# Altium schematic sheet Microcontroller.SchDoc
size A4; SheetNumber: 8; SheetTotal: 10
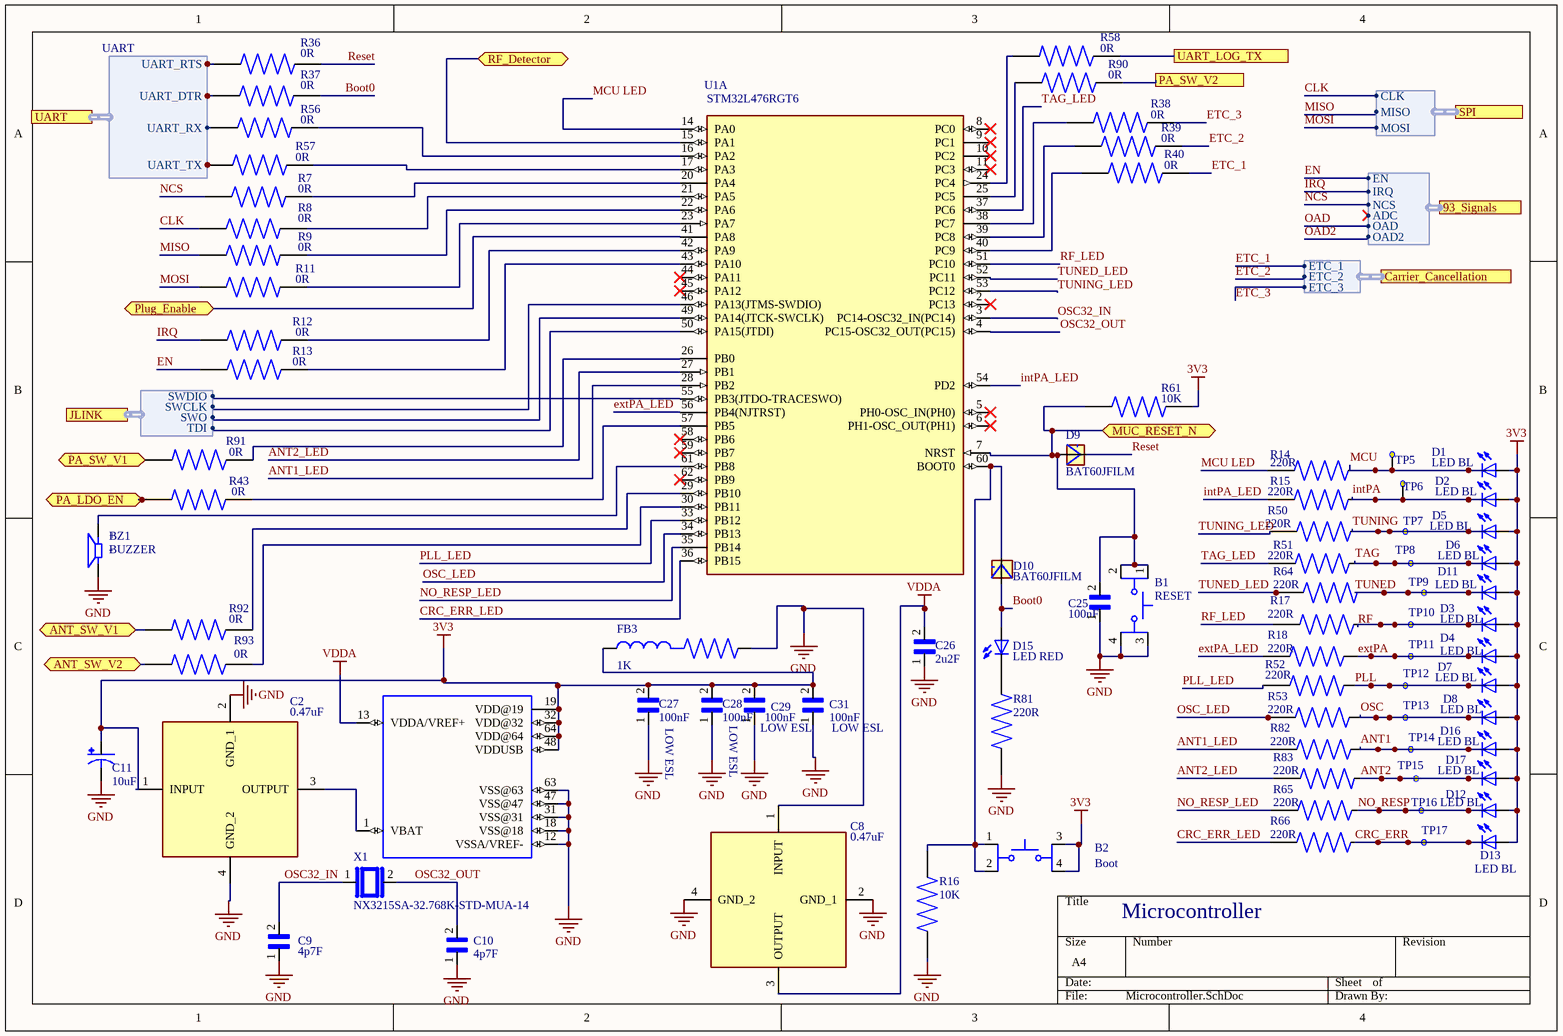
[diagram p0: Microcontroller.SchDoc]

## Parts
B1  RESET  [SW_TL3301AF160QG]
B2  Boot  [SW_TL3301AF160QG]
BZ1  BUZZER  [SPKR_PKMCS0909E4000-R1]
C2  0.47uF  [NFM18CC101R1C3D]
C8  0.47uF  [NFM18CC101R1C3D]
C9  4p7F  [CAPC1005X55N]
C10  4p7F  [CAPC1005X55N]
C11  10uF  [2917(POL)]
C25  100nF  [CAPC1005X55N]
C26  2u2F  [CAPC0603X35N]
C27  100nF  [CAPC0510X35N]
C28  100nF  [CAPC0510X35N]
C29  100nF  [CAPC0510X35N]
C31  100nF  [CAPC0510X35N]
D1  LED BL  [LED_0402]
D2  LED BL  [LED_0402]
D3  LED BL  [LED_0402]
D4  LED BL  [LED_0402]
D5  LED BL  [LED_0402]
D6  LED BL  [LED_0402]
D7  LED BL  [LED_0402]
D8  LED BL  [LED_0402]
D9  BAT60JFILM  [SOD323]
D10  BAT60JFILM  [SOD323]
D11  LED BL  [LED_0402]
D12  LED BL  [LED_0402]
D13  LED BL  [LED_0402]
D15  LED RED  [LED_0402]
D16  LED BL  [LED_0402]
D17  LED BL  [LED_0402]
FB3  1K  [BEADC1005X55N]
R7  0R  [RESC1005X37N]
R8  0R  [RESC1005X37N]
R9  0R  [RESC1005X37N]
R11  0R  [RESC1005X37N]
R12  0R  [RESC1005X37N]
R13  0R  [RESC1005X37N]
R14  220R  [RESC1005X40N]
R15  220R  [RESC1005X40N]
R16  10K  [RESC1005X40N]
R17  220R  [RESC1005X40N]
R18  220R  [RESC1005X40N]
R36  0R  [RESC1005X37N]
R37  0R  [RESC1005X37N]
R38  0R  [RESC1005X37N]
R39  0R  [RESC1005X37N]
R40  0R  [RESC1005X37N]
R43  0R  [RESC1005X37N]
R50  220R  [RESC1005X40N]
R51  220R  [RESC1005X40N]
R52  220R  [RESC1005X40N]
R53  220R  [RESC1005X40N]
R56  0R  [RESC1005X37N]
R57  0R  [RESC1005X37N]
R58  0R  [RESC1005X37N]
R61  10K  [RESC1005X40N]
R64  220R  [RESC1005X40N]
R65  220R  [RESC1005X40N]
R66  220R  [RESC1005X40N]
R81  220R  [RESC1005X40N]
R82  220R  [RESC1005X40N]
R83  220R  [RESC1005X40N]
R90  0R  [RESC1005X37N]
R91  0R  [RESC1005X37N]
R92  0R  [RESC1005X37N]
R93  0R  [RESC1005X37N]
TP5  Testpoint  [Testpoint_FP]  (value not drawn)
TP6  Testpoint  [Testpoint_FP]  (value not drawn)
TP7  Testpoint  [Testpoint_FP]  (value not drawn)
TP8  Testpoint  [Testpoint_FP]  (value not drawn)
TP9  Testpoint  [Testpoint_FP]  (value not drawn)
TP10  Testpoint  [Testpoint_FP]  (value not drawn)
TP11  Testpoint  [Testpoint_FP]  (value not drawn)
TP12  Testpoint  [Testpoint_FP]  (value not drawn)
TP13  Testpoint  [Testpoint_FP]  (value not drawn)
TP14  Testpoint  [Testpoint_FP]  (value not drawn)
TP15  Testpoint  [Testpoint_FP]  (value not drawn)
TP16  Testpoint  [Testpoint_FP]  (value not drawn)
TP17  Testpoint  [Testpoint_FP]  (value not drawn)
U1A  STM32L476RGT6  [LQFP-64(10X10)MM]
X1  NX3215SA-32.768K-STD-MUA-14  [XTAL_NX3215SA-32.768K-STD-MUA-14]

## Ports
93_Signals (harness 93_Signals, see System Overview[2B], External interfaces and connections[1B], UHF RFID READER IC[1A]), ANT_SW_V1 (bidir, see System Overview[2C], Antenna Switch[2B], External interfaces and connections[3D]), ANT_SW_V2 (bidir, see System Overview[2C], Antenna Switch[2B], External interfaces and connections[3D]), Carrier_Cancellation (harness Carrier Cancellation, see System Overview[2B], Carrier Cancellation Circuit[1A], External interfaces and connections[1A]), JLINK (harness JLINK, see System Overview[2C], External interfaces and connections[4A]), MUC_RESET_N (bidir, see System Overview[2C], External interfaces and connections[4B]), PA_LDO_EN (bidir, see System Overview[2C], External interfaces and connections[1D], Supply LDOs[2C]), PA_SW_V1 (bidir, see System Overview[2C], External interfaces and connections[3C], External Power Amplifier[4A]), PA_SW_V2 (see System Overview[2C], External interfaces and connections[3D], External Power Amplifier[4A]), Plug_Enable (bidir, see System Overview[2D], Supply LDOs[1B]), RF_Detector (bidir, see System Overview[2C], External interfaces and connections[4D], External Power Amplifier[3D]), SPI (harness SPI, see System Overview[2B], Carrier Cancellation Circuit[1A], External interfaces and connections[1A], UHF RFID READER IC[1A]), UART (harness UART, see System Overview[2C], External interfaces and connections[1C], USB suply_UART bridge[4D]), UART_LOG_TX (see System Overview[2C], External interfaces and connections[1D])

## Harnesses
UART: UART_RTS, UART_DTR, UART_RX, UART_TX
JLINK: SWDIO, SWCLK, SWO, TDI
SPI: CLK, MISO, MOSI
93_Signals: EN, IRQ, NCS, ADC, OAD, OAD2
Carrier Cancellation: ETC_1, ETC_2, ETC_3

## Nets
3V3: B2.3 B2.4 C2.1(INPUT) C11.1(POS) C27.2 C28.2 C29.2 C31.2 D1.A D2.A D3.A D4.A D5.A D6.A D7.A D8.A D11.A D12.A D13.A D16.A D17.A FB3.1 R61.2 U1A.19(VDD@19) U1A.32(VDD@32) U1A.48(VDDUSB) U1A.64(VDD@64)
GND: B1.3 B1.4 BZ1.2(N) C2.2(GND_1) C2.4(GND_2) C8.1(INPUT) C8.2(GND_1) C8.4(GND_2) C9.1 C10.1 C11.2(NEG) C25.1 C26.1 C27.1 C28.1 C29.1 C31.1 FB3.2 R16.1 R81.1 U1A.12(VSSA/VREF-) U1A.18(VSS@18) U1A.31(VSS@31) U1A.47(VSS@47) U1A.63(VSS@63)
VDDA: C8.3(OUTPUT) C26.2 U1A.13(VDDA/VREF+)
ANT1: D16.C R82.2 TP14.TP?(Testpoint)
ANT1_LED: R82.1 U1A.28(PB2)
ANT2: D17.C R83.2 TP15.TP?(Testpoint)
ANT2_LED: R83.1 U1A.27(PB1)
ANT_SW_V1: R92.1 ; port ANT_SW_V1
ANT_SW_V2: R93.1 ; port ANT_SW_V2
Boot0: D10.A D15.A R37.2
CLK: R8.1 ; port SPI.CLK
CRC_ERR: D13.C R66.2 TP17.TP?(Testpoint)
CRC_ERR_LED: R66.1 U1A.36(PB15)
EN: R13.1 ; port 93_Signals.EN
ETC_1: R40.2 ; port Carrier_Cancellation.ETC_1
ETC_2: R39.2 ; port Carrier_Cancellation.ETC_2
ETC_3: R38.2 ; port Carrier_Cancellation.ETC_3
extPA: D4.C R18.2 TP11.TP?(Testpoint)
extPA_LED: R18.1 U1A.56(PB4(NJTRST))
intPA: D2.C R15.2 TP6.TP?(Testpoint)
intPA_LED: R15.1 U1A.54(PD2)
IRQ: R12.1 ; port 93_Signals.IRQ
MCU: D1.C R14.2 TP5.TP?(Testpoint)
MCU LED: R14.1 U1A.14(PA0)
MISO: R9.1 ; port SPI.MISO
MOSI: R11.1 ; port SPI.MOSI
MUC_RESET_N: B1.1 B1.2 C25.2 D9.A R61.1 U1A.7(NRST) ; port MUC_RESET_N
NCS: R7.1 ; port 93_Signals.NCS
NO_RESP: D12.C R65.2 TP16.TP?(Testpoint)
NO_RESP_LED: R65.1 U1A.35(PB14)
OAD: port 93_Signals.OAD
OAD2: port 93_Signals.OAD2
OSC: D8.C R53.2 TP13.TP?(Testpoint)
OSC32_IN: C9.2 U1A.3(PC14-OSC32_IN(PC14)) X1.1
OSC32_OUT: C10.2 U1A.4(PC15-OSC32_OUT(PC15)) X1.2
OSC_LED: R53.1 U1A.34(PB13)
PA_LDO_EN: R43.1 ; port PA_LDO_EN
PA_SW_V1: R91.1 ; port PA_SW_V1
PA_SW_V2: R90.2 ; port PA_SW_V2
PLL: D7.C R52.2 TP12.TP?(Testpoint)
PLL_LED: R52.1 U1A.33(PB12)
Plug_Enable: U1A.41(PA8) ; port Plug_Enable
Reset: D9.C R36.2
RF: D3.C R17.2 TP10.TP?(Testpoint)
RF_Detector: U1A.15(PA1) ; port RF_Detector
RF_LED: R17.1 U1A.51(PC10)
TAG: D6.C R51.2 TP8.TP?(Testpoint)
TAG_LED: R51.1 U1A.37(PC6)
TUNED: D11.C R64.2 TP9.TP?(Testpoint)
TUNED_LED: R64.1 U1A.52(PC11)
TUNING: D5.C R50.2 TP7.TP?(Testpoint)
TUNING_LED: R50.1 U1A.53(PC12)
UART_LOG_TX: R58.2 ; port UART_LOG_TX
NetB2_1: B2.1 B2.2 D10.C R16.2 U1A.60(BOOT0)
NetBZ1_1: BZ1.1(P) U1A.61(PB8)
NetC2_3: C2.3(OUTPUT) U1A.1(VBAT)
NetD15_C: D15.C R81.2
NetR7_2: R7.2 U1A.20(PA4)
NetR8_2: R8.2 U1A.21(PA5)
NetR9_2: R9.2 U1A.22(PA6)
NetR11_2: R11.2 U1A.23(PA7)
NetR12_2: R12.2 U1A.42(PA9)
NetR13_2: R13.2 U1A.43(PA10)
NetR36_1: R36.1 ; port UART.UART_RTS
NetR37_1: R37.1 ; port UART.UART_DTR
NetR38_1: R38.1 U1A.38(PC7)
NetR39_1: R39.1 U1A.39(PC8)
NetR40_1: R40.1 U1A.40(PC9)
NetR43_2: R43.2 U1A.57(PB5)
NetR56_1: R56.1 ; port UART.UART_RX
NetR56_2: R56.2 U1A.16(PA2)
NetR57_1: R57.1 ; port UART.UART_TX
NetR57_2: R57.2 U1A.17(PA3)
NetR58_1: R58.1 U1A.24(PC4)
NetR90_1: R90.1 U1A.25(PC5)
NetR91_2: R91.2 U1A.26(PB0)
NetR92_2: R92.2 U1A.29(PB10)
NetR93_2: R93.2 U1A.30(PB11)
NetU1A_46: U1A.46(PA13(JTMS-SWDIO)) ; port JLINK.SWCLK
NetU1A_49: U1A.49(PA14(JTCK-SWCLK)) ; port JLINK.SWO
NetU1A_50: U1A.50(PA15(JTDI)) ; port JLINK.TDI
NetU1A_55: U1A.55(PB3(JTDO-TRACESWO)) ; port JLINK.SWDIO

Not connected (* = marked no-connect by the designer): U1A 2(PC13)* 5(PH0-OSC_IN(PH0))* 6(PH1-OSC_OUT(PH1))* 8(PC0)* 9(PC1)* 10(PC2)* 11(PC3)* 44(PA11)* 45(PA12)* 58(PB6)* 59(PB7)* 62(PB9)*

## Notes on the sheet
- (near U1A) LOW ESL
- Microcontroller
- (in symbol PKMCS0909E4000-R1) +; -

## Library data of the parts
B1 B2 = TL3301AF160QG: Tactile Switch SPST-NO Top Actuated Surface Mount; MF: E-Switch; SnapEDA_Link: https://www.snapeda.com/parts/TL3301AF160QG/E-Switch/view-part/?ref=snap; Package: None; MP: TL3301AF160QG; Check_prices: https://www.snapeda.com/parts/TL3301AF160QG/E-Switch/view-part/?ref=eda; Purchase-URL: https://pricing.snapeda.com/search/part/TL3301AF160QG/?ref=eda; Digi-Key_Part_Number: EG2526TR-ND; Value: *
BZ1 = PKMCS0909E4000-R1: Buzzers Transducer, Externally Driven Piezo 1.5V 4kHz 65dB @ 1.5V, 10cm Surface Mount Solder Pads; MF: Murata; SnapEDA_Link: https://www.snapeda.com/parts/PKMCS0909E4000-R1/Murata/view-part/4970136/?ref=snap; Arrow_Electronics-Purchase-URL: https://snapeda.com/shop?store=Arrow+Electronics&id=4970136; DigiKey-Purchase-URL: https://snapeda.com/shop?store=DigiKey&id=4970136; Digi-Key_Part_Number: 490-9647-1-ND; MP: PKMCS0909E4000-R1; Package: SMD-2 Murata; Mouser-Purchase-URL: https://snapeda.com/shop?store=Mouser&id=4970136; Value: *
C2 C8 = NFM18PS474R0J3D: Capacitor; Manufacturer_Name: Murata Electronics; Datasheet Link: https://psearch.en.murata.com/capacitor/product/NFM18PS474R0J3%23.html; Height: 0.7mm; Manufacturer_Part_Number: NFM18PS474R0J3D; Mouser Part Number: 81-NFM18PS474R0J3D; Mouser Price/Stock: https://www.mouser.co.uk/ProductDetail/Murata-Electronics/NFM18PS474R0J3D?qs=OWtbBJ4e7yHgIGJxSdBqtA%3D%3D; Arrow Part Number: NFM18PS474R0J3D; Arrow Price/Stock: https://www.arrow.com/en/products/nfm18ps474r0j3d/murata-manufacturing?region=nac
C9 C10 = GRM1555C2A4R7CA01D: Cap Ceramic 4.7pF 100V C0G 0.25pF SMD 0402 125Â°C Paper T/R; Package: None; Price: None; Value: *; MP: GRM1555C2A4R7CA01D; Availability: Unavailable
C11 = ECASD41C106M060K00: 10 ÂµF 16 V Aluminum - Polymer Capacitors 2917 (7343 Metric) 60mOhm 1000 Hrs @ 105Â°C; MF: Murata Electronics; SnapEDA_Link: https://www.snapeda.com/parts/ECASD41C106M060K00/Murata+Electronics+North+America/view-part/?ref=snap; Package: 2917 Murata; Value: *; MP: ECASD41C106M060K00; Check_prices: https://www.snapeda.com/parts/ECASD41C106M060K00/Murata+Electronics+North+America/view-part/?ref=eda
C25 = GRM155R71C104KA88D: SMD Capacitor X7R_EIA_ with Capacitance: 0.10uF Tol. 10%. Rated Voltage: 16Vdc; MF: Murata; Package: 1005 Taiyo Yuden; Value: *; MP: GRM155R71C104KA88D; SnapEDA_Link: https://www.snapeda.com/parts/GRM155R71C104KA88D/Murata%20Electronics%20North%20America/view-part/4750/?ref=snap
C26 = GRM033R60J225ME15D: SMD Capacitor X5R(EIA) with Capacitance: 2.2uF Tol. 20%. Rated Voltage: 6.3Vdc; Package: None; Price: None; Value: *; MP: GRM033R60J225ME15D; Availability: Unavailable
C27-C29 C31 = LLL153C80J104ME01E: SMD Capacitor X6S(EIA) with Capacitance: 0.10uF Tol. 20%. Rated Voltage: 6.3Vdc; MF: Murata; Price: None; Value: *; Purchase-URL: https://pricing.snapeda.com/search/part/LLL153C80J104ME01E/?ref=eda; Package: 0510 Murata; SnapEDA_Link: https://www.snapeda.com/parts/LLL153C80J104ME01E/Murata/view-part/4376162/?ref=snap; Availability: Good; MP: LLL153C80J104ME01E
D1-D8 D11-D13 D16 D17 = LNJ947W8CRA: Blue 472nm LED Indication - Discrete 2.9V 0402 (1005 Metric); MF: Panasonic Electronic; SnapEDA_Link: https://www.snapeda.com/parts/LNJ947W8CRA/Panasonic+Electronic+Components/view-part/?ref=snap; Package: 0402 Panasonic; Value: *; MP: LNJ947W8CRA; Check_prices: https://www.snapeda.com/parts/LNJ947W8CRA/Panasonic+Electronic+Components/view-part/?ref=eda
D9 D10 = BAT60JFILM: Diode Schottky 10 V 3A (DC) Surface Mount SOD-323; MF: STMicroelectronics; Package: SOD-323 STMicroelectronics; Price: None; Check_prices: https://www.snapeda.com/parts/BAT60JFILM/STMicroelectronics/view-part/?ref=eda; Value: *; SnapEDA_Link: https://www.snapeda.com/parts/BAT60JFILM/STMicroelectronics/view-part/?ref=snap; MP: BAT60JFILM; Availability: In Stock; Purchase-URL: https://pricing.snapeda.com/search?q=BAT60JFILM&ref=eda
D15 = LNJ247W82RA: Red 630nm LED Indication - Discrete 1.95V 0402 (1005 Metric); MF: Panasonic Electronic; Package: 0402 Panasonic; Price: None; Check_prices: https://www.snapeda.com/parts/LNJ247W82RA/Panasonic+Electronic+Components/view-part/?ref=eda; Value: *; SnapEDA_Link: https://www.snapeda.com/parts/LNJ247W82RA/Panasonic+Electronic+Components/view-part/?ref=snap; MP: LNJ247W82RA; Availability: In Stock; Purchase-URL: https://pricing.snapeda.com/search?q=LNJ247W82RA&ref=eda
FB3 = BLM15HG102SN1D: 1 kOhms @ 100MHz 1 Signal Line Ferrite Bead 0402 _1005 Metric_ 250mA 1.1Ohm; MF: Murata; Value: *; SnapEDA_Link: https://www.snapeda.com/parts/BLM15HG102SN1D/Murata/view-part/270056/?ref=snap; Digi-Key_Part_Number: 490-3999-1-ND; Digi-Key_Purchase_URL: https://www.digikey.com/product-detail/en/murata-electronics/BLM15HG102SN1D/490-3999-1-ND/1016259?utm_source=snapeda&utm_medium=aggregator&utm_campaign=symbol; Package: 1005 Taiyo Yuden; MP: BLM15HG102SN1D
R7-R9 R11-R13 R36-R40 R43 R56-R58 R90-R93 = RC0402JR-070RL: MF: {'manufacturer': u'YAGEO'}; Package: None; Price: None; Value: *; MP: RC0402JR-070RL; Availability: Unavailable
R14 R15 R17 R18 R50-R53 R64-R66 R81-R83 = RC0402JR-07220RL: 220 Ohms ±5% 0.063W, 1/16W Chip Resistor 0402 (1005 Metric) Moisture Resistant Thick Film; MF: Yageo; SnapEDA_Link: https://www.snapeda.com/parts/RC0402JR-07220RL/Yageo/view-part/?ref=snap; Package: 1005 Panasonic Electronic Components; Value: *; MP: RC0402JR-07220RL; Check_prices: https://www.snapeda.com/parts/RC0402JR-07220RL/Yageo/view-part/?ref=eda
R16 R61 = RC0402FR-0710KL: 10 kOhms Â±1% 0.063W, 1/16W Chip Resistor 0402 (1005 Metric) Moisture Resistant Thick Film; MF: Yageo; Package: 0402 Yageo; Price: None; Check_prices: https://www.snapeda.com/parts/RC0402FR-0710KL/Yageo/view-part/?ref=eda; Value: *; SnapEDA_Link: https://www.snapeda.com/parts/RC0402FR-0710KL/Yageo/view-part/?ref=snap; MP: RC0402FR-0710KL; Availability: In Stock; Purchase-URL: https://pricing.snapeda.com/search?q=RC0402FR-0710KL&ref=eda
U1A = STM32L476RGT6: ARMÂ® CortexÂ®-M4 STM32L4 Microcontroller IC 32-Bit Single-Core 80MHz 1MB (1M x 8) FLASH 64-LQFP (10x10); MF: STMicroelectronics; Package: LQFP-64 STMicroelectronics; Price: None; Check_prices: https://www.snapeda.com/parts/STM32L476RGT6/STMicroelectronics/view-part/?ref=eda; Value: *; SnapEDA_Link: https://www.snapeda.com/parts/STM32L476RGT6/STMicroelectronics/view-part/?ref=snap; MP: STM32L476RGT6; Availability: In Stock; Purchase-URL: https://pricing.snapeda.com/search?q=STM32L476RGT6&ref=eda
X1 = NX3215SA-32.768K-STD-MUA-14: 32.768 kHz Â±20ppm Crystal 6pF 70 kOhms 2-SMD, No Lead; MF: NDK America,; SnapEDA_Link: https://www.snapeda.com/parts/NX3215SA-32.768K-STD-MUA-14/NDK+America%252C+Inc./view-part/?ref=snap; Package: SMD-2 NDK; Value: *; MP: NX3215SA-32.768K-STD-MUA-14; Check_prices: https://www.snapeda.com/parts/NX3215SA-32.768K-STD-MUA-14/NDK+America%252C+Inc./view-part/?ref=eda